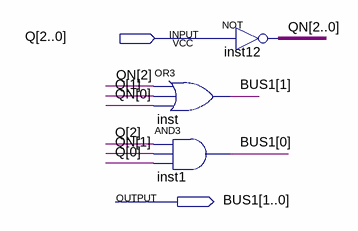
[diagram p0: schematic sheet]
// Quartus schematic BUS1.bdf as structural Verilog: 3 symbols, 2 pins
module BUS1 (
  input  [2:0] Q,
  output [1:0] BUS1
);

  wire [2:0] QN;

  or inst (BUS1[1], QN[2], Q[1], QN[0]);
  and inst1 (BUS1[0], Q[2], QN[1], Q[0]);
  assign QN = ~Q;  // NOT inst12, 3 bits wide
endmodule
